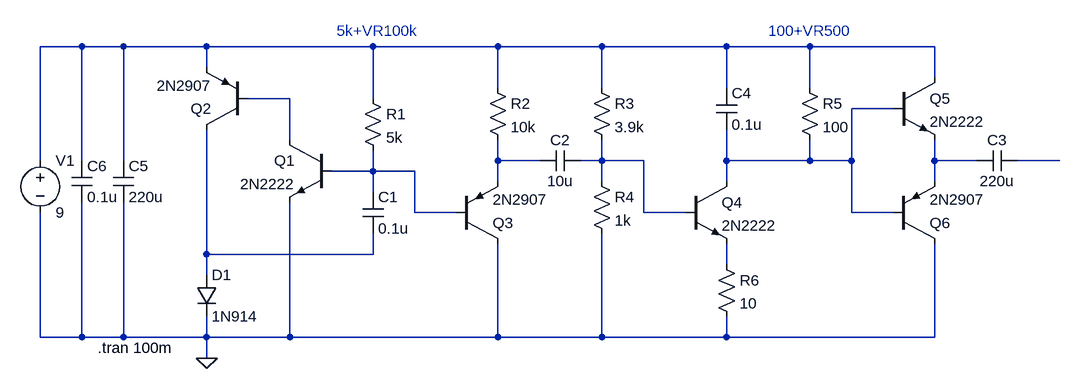
[diagram p0: schematic RelaxationOscillator.asc]
RelaxationOscillator.asc, the LTspice schematic file:
Version 4
SHEET 1 1928 680
WIRE 304 32 240 32
WIRE 368 32 304 32
WIRE 496 32 368 32
WIRE 752 32 496 32
WIRE 944 32 752 32
WIRE 1104 32 944 32
WIRE 1296 32 1104 32
WIRE 1424 32 1296 32
WIRE 1616 32 1424 32
WIRE 496 64 496 32
WIRE 1616 80 1616 32
WIRE 944 96 944 32
WIRE 1104 96 1104 32
WIRE 1296 96 1296 32
WIRE 1424 96 1424 32
WIRE 624 112 560 112
WIRE 752 112 752 32
WIRE 1552 128 1488 128
WIRE 624 176 624 112
WIRE 240 208 240 32
WIRE 304 208 304 32
WIRE 368 208 368 32
WIRE 944 208 944 176
WIRE 1008 208 944 208
WIRE 1104 208 1104 176
WIRE 1104 208 1072 208
WIRE 1168 208 1104 208
WIRE 1296 208 1296 160
WIRE 1424 208 1424 176
WIRE 1424 208 1296 208
WIRE 1488 208 1488 128
WIRE 1488 208 1424 208
WIRE 1616 208 1616 176
WIRE 1680 208 1616 208
WIRE 1808 208 1744 208
WIRE 752 224 752 192
WIRE 752 224 688 224
WIRE 816 224 752 224
WIRE 944 240 944 208
WIRE 1104 240 1104 208
WIRE 1296 240 1296 208
WIRE 1616 240 1616 208
WIRE 752 256 752 224
WIRE 816 288 816 224
WIRE 880 288 816 288
WIRE 1168 288 1168 208
WIRE 1232 288 1168 288
WIRE 1488 288 1488 208
WIRE 1552 288 1488 288
WIRE 496 352 496 160
WIRE 752 352 752 320
WIRE 752 352 496 352
WIRE 1296 368 1296 336
WIRE 496 384 496 352
WIRE 240 480 240 288
WIRE 304 480 304 272
WIRE 304 480 240 480
WIRE 368 480 368 272
WIRE 368 480 304 480
WIRE 496 480 496 448
WIRE 496 480 368 480
WIRE 624 480 624 272
WIRE 624 480 496 480
WIRE 944 480 944 336
WIRE 944 480 624 480
WIRE 1104 480 1104 320
WIRE 1104 480 944 480
WIRE 1296 480 1296 448
WIRE 1296 480 1104 480
WIRE 1616 480 1616 336
WIRE 1616 480 1296 480
WIRE 496 512 496 480
FLAG 496 512 0
SYMBOL npn 688 176 M0
SYMATTR InstName Q1
SYMATTR Value 2N2222
SYMBOL cap 736 256 R0
SYMATTR InstName C1
SYMATTR Value 0.1u
SYMBOL res 736 96 R0
SYMATTR InstName R1
SYMATTR Value 5k
SYMBOL pnp 560 160 R180
SYMATTR InstName Q2
SYMATTR Value 2N2907
SYMBOL voltage 240 192 R0
WINDOW 123 0 0 Left 0
WINDOW 39 0 0 Left 0
SYMATTR InstName V1
SYMATTR Value 9
SYMBOL diode 480 384 R0
SYMATTR InstName D1
SYMATTR Value 1N914
SYMATTR Description Light Emitting Diode
SYMATTR Type led
SYMBOL pnp 880 336 M180
SYMATTR InstName Q3
SYMATTR Value 2N2907
SYMBOL res 928 80 R0
SYMATTR InstName R2
SYMATTR Value 10k
SYMBOL cap 1072 192 R90
WINDOW 0 0 32 VBottom 2
WINDOW 3 32 32 VTop 2
SYMATTR InstName C2
SYMATTR Value 10u
SYMBOL res 1088 80 R0
SYMATTR InstName R3
SYMATTR Value 3.9k
SYMBOL res 1088 224 R0
SYMATTR InstName R4
SYMATTR Value 1k
SYMBOL npn 1232 240 R0
SYMATTR InstName Q4
SYMATTR Value 2N2222
SYMBOL res 1280 352 R0
SYMATTR InstName R6
SYMATTR Value 10
SYMBOL cap 1280 96 R0
SYMATTR InstName C4
SYMATTR Value 0.1u
SYMBOL npn 1552 80 R0
SYMATTR InstName Q5
SYMATTR Value 2N2222
SYMBOL pnp 1552 336 M180
SYMATTR InstName Q6
SYMATTR Value 2N2907
SYMBOL res 1408 80 R0
SYMATTR InstName R5
SYMATTR Value 100
SYMBOL cap 1744 192 R90
WINDOW 0 0 32 VBottom 2
WINDOW 3 32 32 VTop 2
SYMATTR InstName C3
SYMATTR Value 220u
SYMBOL cap 352 208 R0
SYMATTR InstName C5
SYMATTR Value 220u
SYMBOL cap 288 208 R0
SYMATTR InstName C6
SYMATTR Value 0.1u
TEXT 328 496 Left 2 !.tran 100m
TEXT 696 8 Left 2 ;5k+VR100k
TEXT 1360 8 Left 2 ;100+VR500

The netlist it stands for:
* RelaxationOscillator.asc
Q1 N002 N008 0 0 2N2222
C1 N008 N009 0.1u
R1 N001 N008 5k
Q2 N009 N002 N001 0 2N2907
V1 N001 0 9
D1 N009 0 1N914
Q3 0 N008 N004 0 2N2907
R2 N001 N004 10k
C2 N005 N004 10u
R3 N001 N005 3.9k
R4 N005 0 1k
Q4 N003 N005 N010 0 2N2222
R6 N010 0 10
C4 N001 N003 0.1u
Q5 N001 N003 N006 0 2N2222
Q6 0 N003 N006 0 2N2907
R5 N001 N003 100
C3 N007 N006 220u
C5 N001 0 220u
C6 N001 0 0.1u
.model D D
.lib standard.dio
.model NPN NPN
.model PNP PNP
.lib standard.bjt
.tran 100m
* 5k+VR100k
* 100+VR500
.backanno
.end